# EAGLE design scaremin (EAGLE 7.7.0)
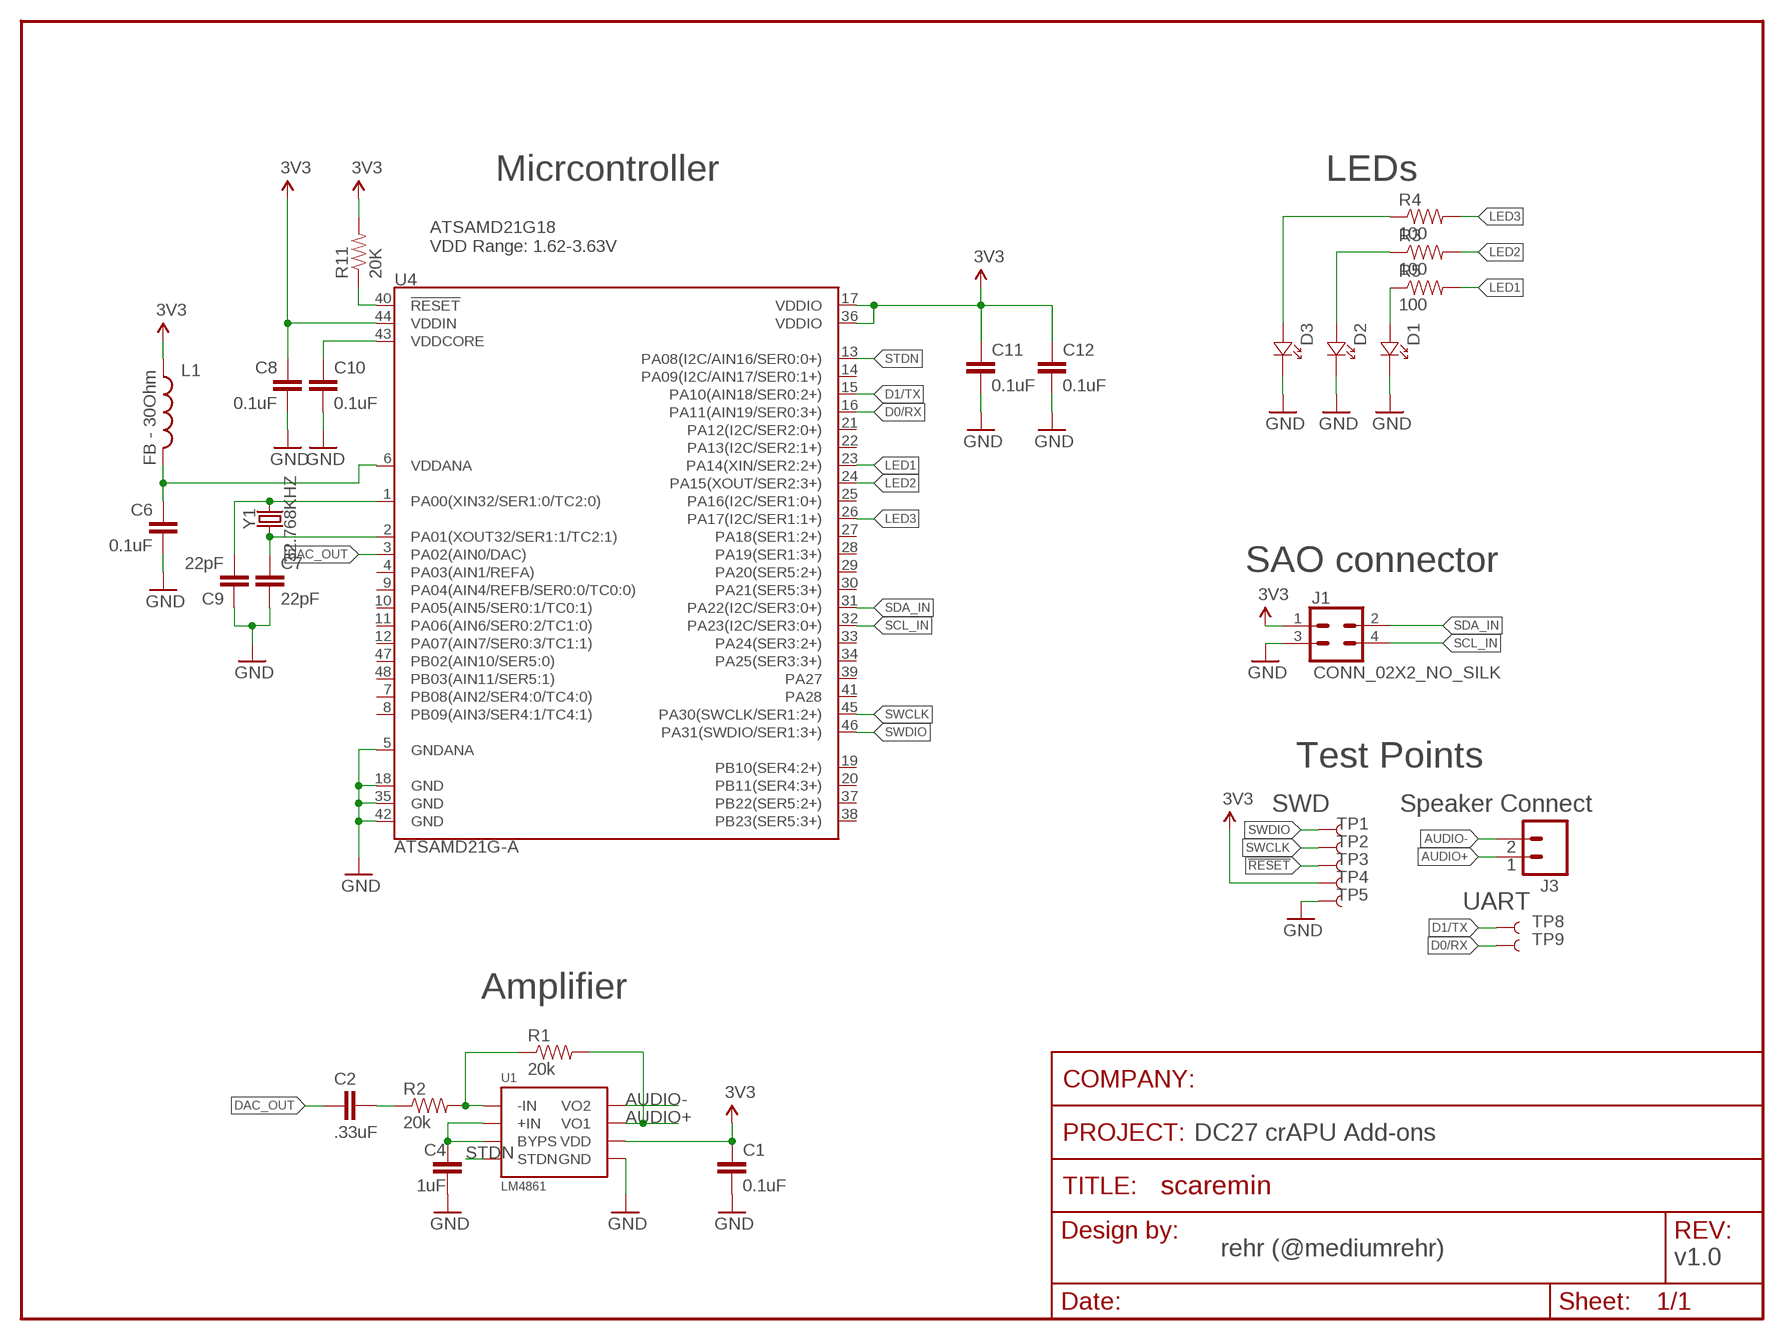
[diagram p0: schematic, sheet 1]

## Parts
C1  0.1uF  CAP0603-CAP  [0603-CAP]
C2  .33uF  CAP0603-CAP  [0603-CAP]
C4  1uF  CAP0603-CAP  [0603-CAP]
C6  0.1uF  0.1UF-25V(+80/-20%)(0603)  [0603-CAP]
C7  22pF  15PF-50V-5%(0603)  [0603-CAP]
C8  0.1uF  0.1UF-25V(+80/-20%)(0603)  [0603-CAP]
C9  22pF  15PF-50V-5%(0603)  [0603-CAP]
C10  0.1uF  0.1UF-25V(+80/-20%)(0603)  [0603-CAP]
C11  0.1uF  0.1UF-25V(+80/-20%)(0603)  [0603-CAP]
C12  0.1uF  0.1UF-25V(+80/-20%)(0603)  [0603-CAP]
D1  LED1206REVERSE_NO_SILK  [1206_NO_SILK]
D2  LED1206REVERSE_NO_SILK  [1206_NO_SILK]
D3  LED1206REVERSE_NO_SILK  [1206_NO_SILK]
FRAME1  FRAME-LETTER-BLANKNO_PACKAGE  [DUMMY]
J1  CONN_02X2_NO_SILK  [2X2_NO_SILK]
J3  M02ROUND  [M02_ROUND]
L1  FB - 30Ohm  INDUCTOR0603  [0603]
R1  20k  RESISTOR0805-RES  [0805]
R2  20k  RESISTOR0805-RES  [0805]
R3  100  10KOHM-1/10W-1%(0603)0603  [0603-RES]
R4  100  10KOHM-1/10W-1%(0603)0603  [0603-RES]
R5  100  10KOHM-1/10W-1%(0603)0603  [0603-RES]
R11  20K  10KOHM-1/10W-1%(0603)0603  [0603-RES]
TP1  TEST-POINT3X5  [PAD.03X.05]
TP2  TEST-POINT3X5  [PAD.03X.05]
TP3  TEST-POINT3X5  [PAD.03X.05]
TP4  TEST-POINT3X5  [PAD.03X.05]
TP5  TEST-POINT3X5  [PAD.03X.05]
TP8  TEST-POINT3X4  [PAD.03X.04]
TP9  TEST-POINT3X4  [PAD.03X.04]
U1  LM4861  [8-SOIC]
U4  ATSAMD21G-A  [TQFP-48]
Y1  32.768KHZ  ABS06-127-32.768KHZ  [ABS06]

## Nets
3.3V: C1.1 C8.1 C11.1 C12.1 J1.1 L1.1 R11.2 TP4.P$1 U1.P$6(VDD) U4.17(VDDIO) U4.36(VDDIO) U4.44(VDDIN) ; supply symbol labelled 3V3
!RESET: R11.1 TP3.P$1 U4.40(!RESET!)
AUDIO+: J3.P$1 R1.2 U1.P$5(VO1)
AUDIO-: J3.P$2 U1.P$8(VO2)
D0/RX: TP9.P$1 U4.16(PA11(AIN19/SER0:3+))
D1/TX: TP8.P$1 U4.15(PA10(AIN18/SER0:2+))
DAC_OUT: C2.2 U4.3(PA02(AIN0/DAC))
GND: C1.2 C4.2 C6.2 C7.2 C8.2 C9.1 C10.2 C11.2 C12.2 D1.P$1 D2.P$1 D3.P$1 J1.3 TP5.P$1 U1.P$7(GND) U4.5(GNDANA) U4.18(GND) U4.35(GND) U4.42(GND)
LED1: R5.2 U4.23(PA14(XIN/SER2:2+))
LED2: R3.2 U4.24(PA15(XOUT/SER2:3+))
LED3: R4.2 U4.26(PA17(I2C/SER1:1+))
N$1: C2.1 R2.1
N$2: R1.1 R2.2 U1.P$4(-IN)
N$3: D1.P$2 R5.1
N$4: C7.1 U4.2(PA01(XOUT32/SER1:1/TC2:1)) Y1.P$1
N$5: C4.1 U1.P$2(BYPS) U1.P$3(+IN)
N$6: D2.P$2 R3.1
N$7: D3.P$2 R4.1
N$9: C9.2 U4.1(PA00(XIN32/SER1:0/TC2:0)) Y1.P$2
SCL_IN: J1.4 U4.32(PA23(I2C/SER3:0+))
SDA_IN: J1.2 U4.31(PA22(I2C/SER3:0+))
STDN: U1.P$1(STDN) U4.13(PA08(I2C/AIN16/SER0:0+))
SWCLK: TP2.P$1 U4.45(PA30(SWCLK/SER1:2+))
SWDIO: TP1.P$1 U4.46(PA31(SWDIO/SER1:3+))
VDDANA: C6.1 L1.2 U4.6(VDDANA)
VDDCORE: C10.1 U4.43(VDDCORE)
Unconnected: U4.4(PA03(AIN1/REFA)) U4.7(PB08(AIN2/SER4:0/TC4:0)) U4.8(PB09(AIN3/SER4:1/TC4:1)) U4.9(PA04(AIN4/REFB/SER0:0/TC0:0)) U4.10(PA05(AIN5/SER0:1/TC0:1)) U4.11(PA06(AIN6/SER0:2/TC1:0)) U4.12(PA07(AIN7/SER0:3/TC1:1)) U4.14(PA09(I2C/AIN17/SER0:1+)) U4.19(PB10(SER4:2+)) U4.20(PB11(SER4:3+)) U4.21(PA12(I2C/SER2:0+)) U4.22(PA13(I2C/SER2:1+)) U4.25(PA16(I2C/SER1:0+)) U4.27(PA18(SER1:2+)) U4.28(PA19(SER1:3+)) U4.29(PA20(SER5:2+)) U4.30(PA21(SER5:3+)) U4.33(PA24(SER3:2+)) U4.34(PA25(SER3:3+)) U4.37(PB22(SER5:2+)) U4.38(PB23(SER5:3+)) U4.39(PA27) U4.41(PA28) U4.47(PB02(AIN10/SER5:0)) U4.48(PB03(AIN11/SER5:1))

## Notes on the sheet
- Micrcontroller | LEDs
- ATSAMD21G18
  VDD Range: 1.62-3.63V
- SAO connector
- Test Points
- SWD | Speaker Connect
- UART
- Amplifier
- DC27 crAPU Add-ons
- rehr (@mediumrehr)
- v1.0

## Library data of the parts
C1 C2 C4 = SparkFun-Passives:CAP: Capacitor Standard 0603 ceramic capacitor, and 0.1" leaded capacitor.
C6 C8 C10-C12 = SparkFun-Capacitors:0.1UF-25V(+80/-20%)(0603): CAP-00810 Ceramic Standard decoupling cap; PROD_ID: CAP-00810
C7 C9 = SparkFun-Capacitors:15PF-50V-5%(0603): CAP-07881; PROD_ID: CAP-07881; VALUE: 15pF
D1-D3 = IDEO-Diodes:LED1206
FRAME1 = SparkFun-Aesthetics:FRAME-LETTER-BLANK: Schematic Frame - Letter Standard 8.5x11 US Letter frame; DESIGNER: Nobody; VERSION: v01
J1 = SparkFun-Connectors:CONN_02X2
J3 = IDEO-Connectors:M02
L1 = SparkFun-Passives:INDUCTOR: Inductors Basic Inductor/Choke - 0603 and 1206. Footprints are not proven and vary greatly between part numbers. INDUCTOR POWER 3.3UH 4.0A SMD 0.197" L x 0.197" W x 0.177" H (5.00mm x 5.00mm x 4.50mm); PROD_ID: RES-07859
R1 R2 = SparkFun-Passives:RESISTOR: Resistor Basic schematic elements and footprints for 0603, 1206, and PTH resistors.
R3-R5 R11 = SparkFun-Resistors:10KOHM-1/10W-1%(0603): RES-00824; PROD_ID: RES-00824; VALUE: 10K
TP1-TP5 TP8 TP9 = SparkFun-Connectors:TEST-POINT: SparkFun Test Points Bare copper test points for troubleshooting or In-Circuit-Testing. These are used by our Production team for verifying production board runs using pogo-pins on test beds. SparkFun Products: SparkFun LSM9DS1 Breakout <https://www.sparkfun.com/products/13284> SparkFun PSOC <https://www.sparkfun.com/products/13714> SparkFun Load Cell Amplifier <https://www.sparkfun.com/products/13879>
U1 = IDEO-ICs:LM4861
U4 = samd21-temp:ATSAMD21G: Atmel SAMD21G SMART ARM-Based Microcontroller The Atmel ® | SMART ™ SAM D21 is a series of low-power microcontrollers using the 32-bit ARM ® Cortex ® -M0+ processor, and ranging from 32- to 64-pins with up to 256KB Flash and 32KB of SRAM. The SAM D21 devices operate at a maximum frequency of 48MHz and reach 2.46 CoreMark/MHz. They are designed for simple and intuitive migration with identical peripheral modules, hex compatible code, identical linear address map and pin compatible migration paths between all devices in the product series. All devices include intelligent and flexible peripherals, Atmel Event System for inter-peripheral signaling, and support for capacitive touch button, slider and wheel user interfaces.; PROD_ID: IC-13064
Y1 = IDEO-Clocks:ABS06-127-32.768KHZ

## Board
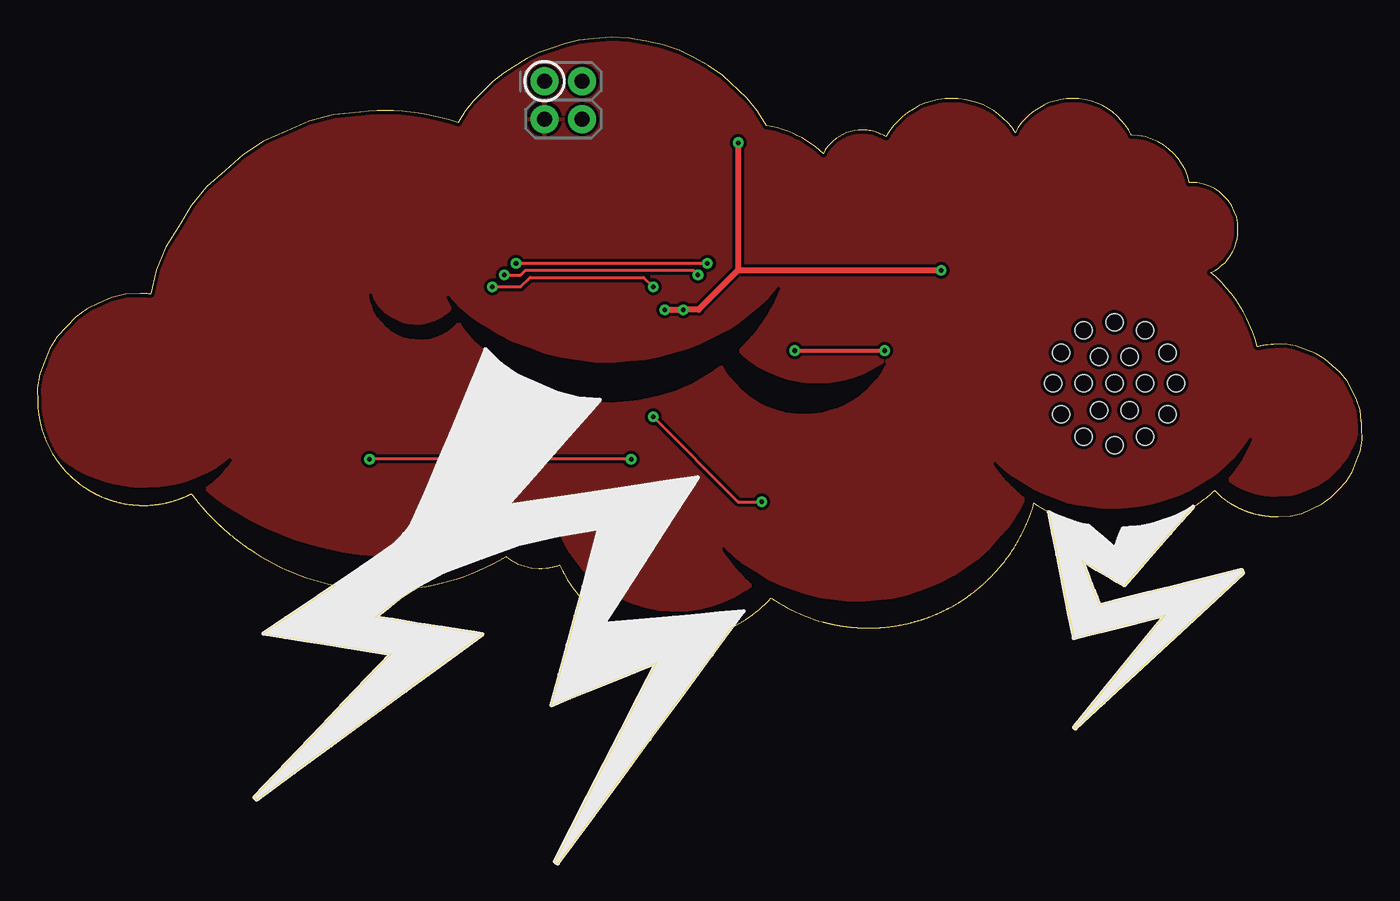
[diagram p1: board, top side]
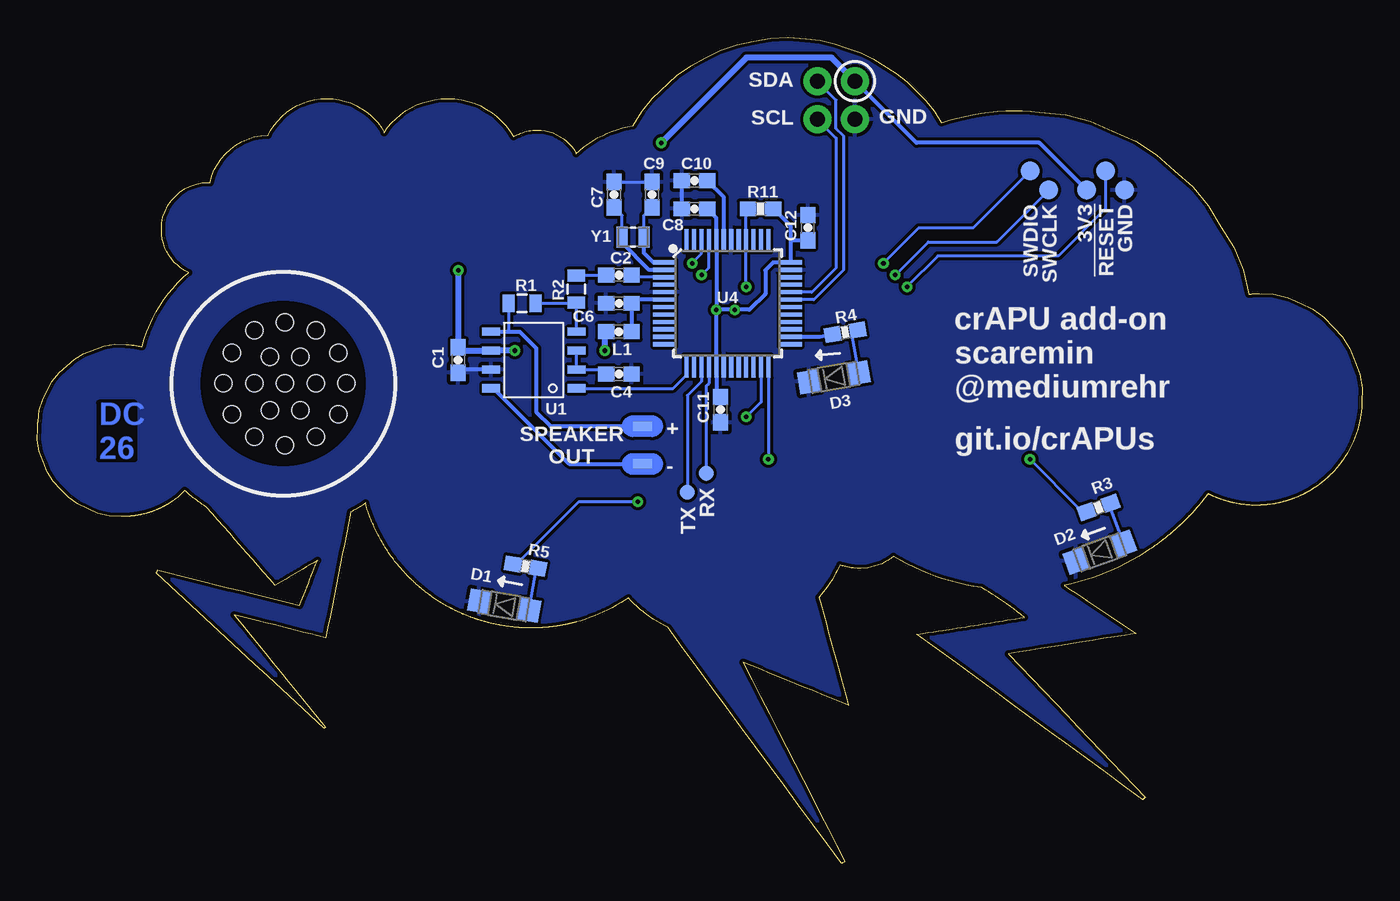
[diagram p2: board, bottom side, seen from below]

Size 89.04 x 55.53 mm. Coordinates in mm from the lower left corner, seen from the top.
Outline: 88.98,29.72 88.98,29.72
Outline: 88.98,29.72 88.9,30.46 88.68,31.16 88.35,31.79 88.02,32.42 87.57,32.98 86.52,33.91 85.9,34.28 84.56,34.77 83.83,34.9 83.07,34.87 82.98,34.87 82.89,34.87 82.7,34.85 82.61,34.84 82.52,34.83 82.43,34.82 82.34,34.81 82.25,34.79 82.16,34.77 82.07,34.76 81.99,34.74 81.86,35.23 81.69,35.71 81.29,36.64 81.06,37.08 80.53,37.91 80.23,38.31 79.91,38.68 79.59,39.05 79.24,39.4 78.87,39.72 79.13,39.85 79.38,40.01 79.6,40.2 79.82,40.4 80.02,40.62 80.18,40.87 80.34,41.12 80.46,41.39 80.55,41.68 80.64,41.96 80.68,42.27 80.68,43.02 80.6,43.44 80.43,43.82 80.27,44.2 80.04,44.54 79.75,44.83 79.47,45.12 79.12,45.35 78.74,45.51 78.36,45.67 77.95,45.76 77.5,45.76 77.49,45.76 77.48,45.76 77.48,45.76 77.47,45.76 77.46,45.76 77.45,45.76 77.44,45.76 77.43,45.76 77.42,45.76 77.41,45.76 77.31,46.21 77.14,46.63 76.91,47 76.67,47.38 76.38,47.72 76.04,48 75.69,48.29 75.31,48.51 74.46,48.83 74,48.92 73.53,48.93 73.35,49.3 73.12,49.64 72.85,49.94 72.58,50.24 72.27,50.5 71.93,50.72 71.59,50.94 71.22,51.11 70.82,51.23 70.43,51.34 70.01,51.41 69.16,51.41 68.75,51.35 68.37,51.24 67.99,51.13 67.63,50.98 67.3,50.78 66.97,50.58 66.67,50.33 66.4,50.06 66.13,49.78 65.9,49.47 65.71,49.13 65.48,49.47 65.21,49.79 64.91,50.06 64.61,50.34 64.27,50.58 63.91,50.78 63.54,50.98 63.15,51.14 62.33,51.35 61.9,51.41 60.98,51.41 60.53,51.34 59.66,51.1 59.24,50.92 58.86,50.7 58.48,50.47 58.14,50.2 57.83,49.89 57.52,49.58 57.25,49.23 57.03,48.84 56.91,48.91 56.8,48.98 56.67,49.03 56.55,49.09 56.42,49.13 56.29,49.17 56.16,49.21 56.02,49.24 55.88,49.26 55.75,49.28 55.6,49.29 55.17,49.29 54.9,49.25 54.64,49.17 54.38,49.1 54.13,48.99 53.9,48.85 53.67,48.71 53.47,48.55 53.28,48.35 53.1,48.16 52.95,47.95 52.82,47.71 52.56,47.95 52.28,48.18 51.98,48.38 51.69,48.58 51.38,48.77 51.06,48.92 50.74,49.08 50.41,49.22 50.06,49.33 49.72,49.44 49.36,49.53 49,49.59 48.41,50.56 47.69,51.44 46.05,52.97 45.12,53.63 44.12,54.14 43.11,54.66 42.03,55.03 40.9,55.25 39.77,55.47 38.59,55.53 37.38,55.41 36.41,55.32 35.47,55.11 34.59,54.8 33.7,54.5 32.87,54.09 31.32,53.12 30.61,52.54 29.97,51.9 29.33,51.26 28.76,50.55 28.28,49.78 27.76,49.95 27.24,50.1 26.17,50.33 25.62,50.42 24.52,50.54 23.96,50.58 22.83,50.59 22.26,50.56 21.68,50.5 19.93,50.33 18.28,49.88 16.76,49.21 15.23,48.54 13.84,47.64 12.62,46.55 11.39,45.47 10.34,44.21 9.5,42.82 8.65,41.42 8.01,39.89 7.62,38.28 7.57,38.28 7.51,38.28 7.46,38.29 7.41,38.29 7.35,38.29 7.3,38.29 7.24,38.29 7.19,38.29 7.14,38.29 7.08,38.29 7.03,38.29 6.97,38.29 6.97,38.29 6.97,38.29 6.96,38.29 6.96,38.29 6.96,38.29 6.95,38.29 6.95,38.29 6.95,38.29 6.94,38.29 6.93,38.29 6.93,38.29 5.95,38.26 5.02,38.04 4.18,37.65 3.34,37.27 2.59,36.72 1.96,36.06 1.34,35.4 0.84,34.62 0.51,33.76 0.17,32.9 0,31.96 0.03,30.98 0.04,30.66 0.07,30.36 0.16,29.76 0.23,29.47 0.31,29.18 0.4,28.89 0.5,28.62 0.62,28.35 0.73,28.08 0.87,27.82 1.01,27.57 1.04,27.53 1.06,27.49 1.08,27.45 1.11,27.42 1.13,27.38 1.16,27.34 1.18,27.3 1.2,27.27 1.23,27.23 1.25,27.19 1.28,27.16 1.3,27.12 1.32,27.1 1.33,27.09 1.35,27.05 1.36,27.04 1.39,27 1.4,26.98 1.43,26.95 1.44,26.93 1.45,26.92 1.47,26.89 1.49,26.87 1.51,26.84 1.53,26.82 1.55,26.8 1.57,26.77 1.58,26.75 1.6,26.72 1.62,26.7 1.64,26.68 1.66,26.65 1.68,26.63 1.69,26.62 1.71,26.6 1.72,26.59 1.73,26.57 1.74,26.56 1.77,26.53 1.78,26.51 1.79,26.5 1.8,26.48 1.82,26.47 1.83,26.45 1.86,26.42 1.89,26.39 1.92,26.35 1.95,26.32 1.98,26.29 2.04,26.22 2.07,26.19 2.14,26.13 2.17,26.1 2.2,26.07 2.21,26.05 2.23,26.04 2.24,26.03 2.26,26.02 2.27,26 2.28,25.99 2.3,25.98 2.31,25.96 2.33,25.95 2.34,25.94 2.35,25.93 2.37,25.91 2.39,25.89 2.42,25.87 2.44,25.85 2.47,25.83 2.49,25.81 2.52,25.78 2.54,25.76 2.57,25.74 2.59,25.72 2.62,25.7 2.64,25.68 2.67,25.66 2.68,25.65 2.69,25.64 2.71,25.62 2.72,25.61 2.74,25.6 2.75,25.59 2.76,25.58 2.78,25.57 2.8,25.55 2.82,25.54 2.83,25.52 2.87,25.5 2.91,25.47 2.98,25.41 3.02,25.39 3.09,25.33 3.13,25.31 3.17,25.28 3.21,25.26 3.25,25.23 3.29,25.2 3.3,25.2 3.31,25.19 3.33,25.18 3.34,25.17 3.35,25.16 3.37,25.16 3.38,25.15 3.39,25.14 3.41,25.13 3.42,25.12 3.43,25.12 3.45,25.11 3.48,25.09 3.51,25.07 3.54,25.05 3.57,25.03 3.6,25.02 3.63,25 3.67,24.98 3.7,24.96 3.73,24.94 3.76,24.93 3.8,24.91 3.83,24.89 3.84,24.88 3.86,24.88 3.87,24.87 3.88,24.86 3.9,24.85 3.91,24.85 3.93,24.84 3.94,24.83 3.97,24.82 3.98,24.81 4,24.8 4.04,24.78 4.08,24.76 4.13,24.74 4.17,24.72 4.22,24.7 4.26,24.68 4.3,24.66 4.35,24.64 4.44,24.6 4.48,24.58 4.53,24.57 4.54,24.56 4.55,24.56 4.57,24.55 4.58,24.55 4.59,24.54 4.6,24.54 4.61,24.54 4.62,24.53 4.63,24.53 4.64,24.52 4.65,24.52 4.69,24.51 4.73,24.49 4.77,24.48 4.81,24.46 4.85,24.45 4.89,24.44 4.93,24.42 4.97,24.41 5.01,24.4 5.05,24.39 5.09,24.37 5.13,24.36 5.14,24.36 5.15,24.35 5.17,24.35 5.18,24.35 5.2,24.34 5.21,24.34 5.22,24.33 5.24,24.33 5.25,24.33 5.27,24.32 5.28,24.32 5.29,24.32 5.34,24.3 5.39,24.29 5.44,24.28 5.49,24.26 5.54,24.25 5.59,24.24 5.64,24.23 5.69,24.22 5.74,24.21 5.79,24.2 5.84,24.19 5.89,24.18 5.9,24.18 5.9,24.18 5.91,24.18 5.92,24.18 5.92,24.17 5.93,24.17 5.94,24.17 5.94,24.17 5.95,24.17 5.95,24.17 5.96,24.17 5.97,24.17 6.01,24.16 6.06,24.15 6.15,24.14 6.2,24.13 6.25,24.13 6.29,24.12 6.34,24.12 6.39,24.11 6.43,24.11 6.48,24.1 6.53,24.1 6.54,24.1 6.56,24.1 6.57,24.1 6.58,24.1 6.6,24.09 6.63,24.09 6.64,24.09 6.67,24.09 6.68,24.09 6.7,24.09 6.75,24.08 6.8,24.08 6.86,24.08 6.91,24.08 6.97,24.07 7.02,24.07 7.07,24.07 7.13,24.07 7.18,24.07 7.24,24.07 7.29,24.07 7.34,24.07 7.4,24.07 7.46,24.08 7.57,24.08 7.62,24.09 7.73,24.1 7.79,24.1 7.84,24.11 7.9,24.11 7.95,24.12 8,24.13 8.01,24.13 8.02,24.13 8.03,24.13 8.04,24.13 8.05,24.13 8.06,24.13 8.07,24.13 8.08,24.13 8.09,24.14 8.1,24.14 8.1,24.14 8.15,24.14 8.2,24.15 8.25,24.16 8.3,24.17 8.35,24.18 8.39,24.18 8.44,24.19 8.49,24.2 8.58,24.22 8.63,24.23 8.68,24.24 8.69,24.25 8.71,24.25 8.72,24.25 8.74,24.26 8.75,24.26 8.77,24.26 8.78,24.27 8.8,24.27 8.81,24.27 8.82,24.28 8.84,24.28 8.85,24.28 8.9,24.29 8.94,24.3 8.98,24.31 9.02,24.33 9.06,24.34 9.14,24.36 9.18,24.37 9.22,24.39 9.26,24.4 9.3,24.41 9.34,24.42 9.36,24.43 9.38,24.44 9.43,24.45 9.45,24.46 9.47,24.47 9.49,24.47 9.51,24.48 9.53,24.49 9.55,24.5 9.57,24.5 9.59,24.51 9.61,24.52 9.64,24.53 9.67,24.54 9.69,24.55 9.72,24.56 9.77,24.58 9.79,24.59 9.82,24.6 9.84,24.61 9.87,24.62 9.89,24.63 9.93,24.65 9.96,24.66 10,24.68 10.03,24.69 10.06,24.71 10.1,24.72 10.13,24.74 10.17,24.75 10.2,24.77 10.24,24.79 10.27,24.8 10.3,24.82 10.31,24.82 10.31,24.82 10.32,24.83 10.33,24.83 10.34,24.84 10.34,24.84 10.35,24.84 10.36,24.84 10.36,24.85 10.36,24.85
Outline: 10.36,24.85 10.36,24.85
Outline: 10.36,24.85 10.36,24.85 10.36,24.84
Outline: 10.36,24.84 10.36,24.84
Outline: 10.36,24.84 10.36,24.84 10.36,24.84 10.36,24.84 10.36,24.84 10.36,24.84 10.39,24.81 10.41,24.78 10.43,24.75 10.45,24.72 10.48,24.7 10.5,24.67 10.52,24.64 10.55,24.61 10.57,24.58 10.59,24.55 10.61,24.52 10.64,24.49 10.65,24.47 10.67,24.45 10.69,24.43 10.7,24.41 10.72,24.39 10.73,24.37 10.75,24.35 10.76,24.33 10.8,24.29 10.81,24.27 10.83,24.25 10.85,24.22 10.88,24.19 10.93,24.14 10.95,24.11 11,24.05 11.02,24.02 11.07,23.97 11.1,23.94 11.12,23.91 11.14,23.89 11.15,23.87 11.17,23.85 11.19,23.84 11.2,23.82 11.22,23.8 11.24,23.78 11.25,23.76 11.27,23.74 11.28,23.72 11.3,23.7 11.32,23.69 11.34,23.66 11.37,23.63 11.4,23.6 11.42,23.57 11.45,23.54 11.5,23.48 11.53,23.46 11.59,23.4 11.61,23.37 11.64,23.34 11.66,23.33 11.67,23.31 11.69,23.29 11.7,23.28 11.72,23.26 11.73,23.25 11.75,23.23 11.76,23.21 11.78,23.2 11.8,23.18 11.81,23.16 11.83,23.15 11.86,23.12 11.89,23.09 11.95,23.03 11.98,23 12.04,22.94 12.07,22.91 12.13,22.86 12.16,22.83 12.19,22.8 12.2,22.78 12.22,22.77 12.23,22.76 12.24,22.74 12.26,22.73 12.27,22.72 12.29,22.7 12.3,22.69 12.31,22.68 12.33,22.67 12.34,22.65 12.36,22.64 12.39,22.61 12.42,22.58 12.49,22.52 12.52,22.49 12.56,22.46 12.59,22.43 12.63,22.4 12.66,22.37 12.69,22.34 12.73,22.31 12.76,22.28 12.77,22.27 12.79,22.26 12.8,22.25 12.81,22.24 12.82,22.23 12.83,22.22 12.84,22.21 12.86,22.2 12.87,22.19 12.88,22.18 12.89,22.17 12.9,22.16 12.94,22.13 12.98,22.1 13.02,22.07 13.05,22.03 13.09,22 13.13,21.97 13.17,21.94 13.21,21.91 13.28,21.85 13.32,21.82 13.36,21.79 13.37,21.78 13.38,21.78 13.38,21.77 13.39,21.76 13.4,21.76 13.42,21.74 13.43,21.74 13.44,21.73 13.45,21.72 13.45,21.72 13.46,21.71 13.51,21.68 13.55,21.64 13.59,21.61 13.63,21.58 13.68,21.55 13.76,21.49 13.8,21.45 13.85,21.42 13.89,21.39 13.93,21.36 13.98,21.33 13.98,21.33 13.99,21.32 13.99,21.32 14,21.32 14,21.31 14.01,21.31 14.01,21.31 14.02,21.3 14.02,21.3 14.03,21.3 14.03,21.29 14.04,21.29 14.08,21.25 14.13,21.22 14.18,21.19 14.23,21.16 14.27,21.12 14.32,21.09 14.37,21.06 14.42,21.03 14.47,21 14.52,20.97 14.56,20.93 14.61,20.9 14.61,20.9 14.61,20.9 14.62,20.9 14.62,20.9
Outline: 14.62,20.9 14.62,20.9
Outline: 14.62,20.9 14.62,20.9
Outline: 14.62,20.9 14.62,20.9
Outline: 14.62,20.9 14.62,20.9 14.62,20.9 14.62,20.9 15.03,20.64 15.45,20.39 15.88,20.17 16.31,19.95 16.76,19.74 17.21,19.56 17.66,19.37 18.13,19.21 18.6,19.06 19.07,18.92 19.55,18.8 20.04,18.7 19.65,18.44 19.25,18.17 18.86,17.91 18.46,17.64 18.07,17.38 17.66,17.11 17.26,16.84 16.86,16.57 16.03,16.02 15.62,15.74 15.2,15.46 15.95,15.34 16.67,15.23 17.38,15.11 18.1,15 18.8,14.89 20.2,14.67 20.9,14.56 21.61,14.45 22.32,14.33 23.04,14.22 23.79,14.1 22.98,13.26 22.19,12.43 21.41,11.61 20.63,10.79 19.86,9.98 19.1,9.18 18.34,8.38 17.58,7.59 16.83,6.8 16.08,6.01 14.59,4.44 14.62,4.42 14.63,4.4 14.66,4.38 14.67,4.37 14.69,4.35 14.7,4.34 14.71,4.33 14.73,4.31 14.74,4.3 14.75,4.29 16,5.2 17.24,6.11 19.73,7.94 20.98,8.86 23.5,10.7 24.76,11.63 26.04,12.57 27.32,13.51 28.61,14.45 29.92,15.41 29.53,15.47 29.17,15.52 28.83,15.58 28.49,15.63 28.17,15.68 27.54,15.77 27.24,15.82 26.94,15.86 26.65,15.91 26.36,15.95 26.07,16 25.8,16.04 25.53,16.09 25.25,16.13 24.98,16.18 24.7,16.22 24.42,16.27 24.15,16.31 23.87,16.36 23.3,16.45 23.01,16.5 22.72,16.55 22.95,16.74 23.19,16.92 23.42,17.1 23.66,17.27 23.9,17.44 24.37,17.78 24.61,17.94 24.86,18.09 25.1,18.25 25.34,18.4 25.59,18.54 26.12,18.62 26.65,18.72 27.17,18.85 27.68,18.98 28.19,19.13 28.68,19.31 29.17,19.48 29.66,19.68 30.59,20.12 31.05,20.37 31.49,20.63 31.68,20.49 31.87,20.36 32.08,20.25 32.29,20.15 32.51,20.06 32.97,19.92 33.2,19.88 33.69,19.83 33.94,19.83 34.19,19.86 34.27,19.86 34.35,19.87 34.42,19.89 34.5,19.9 34.58,19.92 34.65,19.93 34.73,19.95 34.81,19.97 34.88,19.99 34.95,20.01 35.03,20.04 35.1,20.06 35.19,19.86 35.29,19.67 35.39,19.48 35.5,19.29 35.61,19.1 35.84,18.74 35.97,18.56 36.1,18.39 36.23,18.22 36.36,18.06 36.51,17.89 36.35,17.3 36.18,16.7 36.02,16.1 35.86,15.51 35.7,14.91 35.53,14.31 35.37,13.7 35.2,13.1 35.04,12.49 34.87,11.88 34.71,11.26 34.54,10.64 35.16,10.9 35.76,11.14 36.35,11.38 36.94,11.62 37.51,11.85 38.67,12.32 39.24,12.56 39.82,12.79 40.41,13.03 41,13.27 41.62,13.52 41.01,12.35 40.42,11.19 39.84,10.05 39.26,8.91 38.69,7.79 38.12,6.68 37.55,5.58 36.99,4.48 36.43,3.39 35.87,2.3 35.32,1.21 34.76,0.12 34.78,0.11 34.8,0.1 34.82,0.09 34.84,0.08 34.9,0.05 34.92,0.04 34.94,0.03 34.96,0.02 34.98,0.01 34.99,0 35.95,1.3 36.91,2.6 37.87,3.91 38.83,5.22 39.8,6.53 40.76,7.84 41.73,9.16 42.71,10.48 43.69,11.82 44.67,13.16 45.66,14.5 46.67,15.86 46.92,15.98 47.16,16.12 47.4,16.26 47.64,16.41 47.87,16.57 48.09,16.73 48.31,16.9 48.53,17.08 48.73,17.27 48.93,17.45 49.13,17.65 49.31,17.85 49.58,17.67 49.85,17.5 50.13,17.34 50.41,17.18 50.69,17.04 50.99,16.9 51.28,16.76 51.58,16.64 51.88,16.53 52.19,16.42 52.5,16.32 52.81,16.23 52.82,16.23 52.82,16.23 52.83,16.23 52.84,16.23 52.84,16.22 52.85,16.22 52.86,16.22 52.87,16.22 52.87,16.21 52.88,16.21 52.88,16.21 52.91,16.2 52.94,16.2 52.97,16.19 53,16.18 53.03,16.17 53.06,16.17 53.09,16.16 53.12,16.15 53.15,16.15 53.18,16.14 53.21,16.13 53.24,16.13 53.25,16.12 53.27,16.12 53.28,16.11 53.3,16.11 53.31,16.11 53.33,16.1 53.34,16.1 53.36,16.1 53.37,16.09 53.39,16.09 53.4,16.09 53.42,16.08 53.44,16.08 53.47,16.07 53.49,16.07 53.52,16.06 53.55,16.06 53.57,16.05 53.6,16.05 53.62,16.04 53.65,16.04 53.68,16.03 53.7,16.03 53.73,16.02 53.75,16.02 53.77,16.01 53.8,16.01 53.82,16 53.84,16 53.86,16 53.88,15.99 53.9,15.99 53.92,15.99 53.94,15.98 53.96,15.98 53.98,15.98 54,15.97 54.03,15.97 54.05,15.97 54.08,15.96 54.1,15.96 54.12,15.95 54.15,15.95 54.2,15.94 54.22,15.94 54.25,15.94 54.27,15.93 54.29,15.93 54.31,15.93 54.33,15.93 54.35,15.92 54.38,15.92 54.4,15.92 54.42,15.91 54.44,15.91 54.46,15.91 54.48,15.91 54.51,15.9 54.53,15.9 54.55,15.9 54.57,15.9 54.6,15.89 54.62,15.89 54.64,15.89 54.66,15.89 54.69,15.88 54.73,15.88 54.76,15.88 54.78,15.87 54.8,15.87 54.83,15.87 54.85,15.87 54.87,15.87 54.9,15.86 54.92,15.86 54.95,15.86 54.97,15.86 54.99,15.86 55.02,15.86 55.04,15.85 55.06,15.85 55.09,15.85 55.11,15.85 55.15,15.85 55.17,15.85 55.19,15.84 55.21,15.84 55.24,15.84 55.26,15.84 55.28,15.84 55.3,15.84 55.32,15.84 55.35,15.84 55.37,15.83 55.4,15.83 55.43,15.83 55.45,15.83 55.51,15.83 55.53,15.83 55.56,15.83 55.59,15.83 55.61,15.83 55.64,15.83 55.66,15.83 55.68,15.83 55.7,15.83 55.72,15.83 55.74,15.83 55.76,15.83 55.78,15.83 55.8,15.83 55.81,15.83 55.83,15.82 55.85,15.82 55.87,15.82 55.9,15.82 55.93,15.83 55.97,15.83 56,15.83 56.03,15.83 56.06,15.83 56.09,15.83 56.12,15.83 56.15,15.83 56.18,15.83 56.21,15.83 56.24,15.83 56.26,15.83 56.27,15.83 56.29,15.83 56.3,15.83 56.32,15.84 56.34,15.84 56.35,15.84 56.37,15.84 56.4,15.84 56.42,15.84 56.43,15.84 56.48,15.84 56.53,15.84 56.57,15.85 56.62,15.85 56.67,15.85 56.71,15.86 56.76,15.86 56.81,15.86 56.86,15.87 56.9,15.87 56.95,15.88 57,15.88 57.07,15.89 57.13,15.89 57.2,15.9 57.27,15.91 57.33,15.92 57.4,15.93 57.47,15.94 57.53,15.95 57.6,15.96 57.67,15.97 57.73,15.98 57.8,15.99 57.81,15.99 57.83,16 57.85,16 57.86,16 57.88,16 57.89,16.01 57.91,16.01 57.92,16.01 57.96,16.02 57.97,16.02 57.99,16.02 58.05,16.04 58.12,16.05 58.18,16.06 58.25,16.08 58.31,16.09 58.38,16.1 58.44,16.12 58.5,16.13 58.57,16.15 58.63,16.16 58.7,16.18 58.76,16.19 58.76,16.19 58.77,16.2 58.77,16.2 58.78,16.2 58.78,16.2 58.79,16.2 58.79,16.2 58.8,16.2 58.8,16.2 58.8,16.21 58.81,16.21 58.81,16.21 58.87,16.22 58.93,16.24 58.99,16.26 59.05,16.27 59.11,16.29 59.17,16.31 59.23,16.33 59.29,16.35 59.35,16.36 59.41,16.38 59.46,16.4 59.52,16.42 59.54,16.43 59.55,16.43 59.56,16.43 59.58,16.44 59.59,16.44 59.61,16.45 59.62,16.45 59.63,16.46 59.65,16.46 59.66,16.47 59.67,16.47 59.69,16.48 59.75,16.5 59.81,16.52 59.87,16.54 59.93,16.56 59.99,16.59 60.11,16.63 60.17,16.66 60.23,16.68 60.29,16.71 60.35,16.73 60.41,16.76 60.42,16.76 60.42,16.76 60.43,16.76 60.44,16.77 60.44,16.77 60.45,16.77 60.45,16.78 60.46,16.78 60.47,16.78 60.47,16.78 60.48,16.79 60.48,16.79 60.54,16.81 60.59,16.84 60.65,16.86 60.7,16.89 60.76,16.91 60.87,16.96 60.92,16.99 60.97,17.02 61.03,17.04 61.08,17.07 61.13,17.1 61.14,17.1 61.16,17.11 61.17,17.11 61.18,17.12 61.19,17.13 61.2,17.13 61.21,17.14 61.22,17.14 61.24,17.15 61.25,17.16 61.26,17.16 61.32,17.2 61.38,17.23 61.49,17.29 61.55,17.32 61.61,17.35 61.66,17.38 61.72,17.42 61.77,17.45 61.83,17.48 61.89,17.52 61.94,17.55 61.95,17.55 61.95,17.56 61.96,17.56 61.96,17.56 61.97,17.57 61.97,17.57 61.98,17.58 61.98,17.58 62,17.59 62,17.59 62.01,17.59 62.06,17.63 62.11,17.66 62.21,17.73 62.26,17.76 62.31,17.79 62.36,17.83 62.41,17.86 62.46,17.9 62.51,17.93 62.56,17.97 62.61,18 62.62,18.01 62.63,18.01 62.64,18.02 62.64,18.02 62.65,18.03 62.66,18.03 62.66,18.04 62.67,18.04 62.68,18.05 62.69,18.05 62.69,18.06 62.7,18.06 62.75,18.1 62.81,18.14 62.91,18.22 62.96,18.26 63.02,18.3 63.07,18.35 63.12,18.39 63.17,18.43 63.22,18.47 63.27,18.51 63.32,18.56 63.33,18.56 63.33,18.56 63.34,18.57 63.34,18.57 63.35,18.58 63.35,18.58 63.35,18.58 63.36,18.59 63.36,18.59 63.37,18.59 63.37,18.6 63.42,18.64 63.47,18.68 63.52,18.72 63.57,18.77 63.61,18.81 63.71,18.9 63.76,18.94 63.85,19.03 63.9,19.08 63.94,19.12 63.95,19.12 63.95,19.13 63.95,19.13 63.95,19.13 63.96,19.13 63.96,19.14 63.96,19.14 63.97,19.14 63.97,19.15 63.97,19.15 63.97,19.15 63.98,19.15 64.03,19.2 64.07,19.25 64.17,19.35 64.22,19.4 64.26,19.45 64.31,19.5 64.36,19.55 64.4,19.6 64.45,19.65 64.49,19.7 64.54,19.75 64.54,19.75 64.54,19.75 64.55,19.76 64.55,19.76 64.55,19.76 64.55,19.77 64.56,19.77 64.56,19.77 64.56,19.78 64.56,19.78 64.57,19.78 64.66,19.88 64.75,19.99 64.83,20.1 64.92,20.21 65.01,20.32 65.09,20.43 65.17,20.54 65.26,20.65 65.41,20.88 65.49,20.99 65.57,21.11 65.57,21.11 65.57,21.11 65.57,21.11 65.57,21.11 65.57,21.11 65.57,21.12 65.57,21.12 65.57,21.12 65.58,21.12 65.58,21.12 65.58,21.12 65.58,21.12 65.65,21.24 65.73,21.36 65.8,21.48 65.87,21.6 65.94,21.73 66.01,21.85 66.08,21.97 66.14,22.1 66.21,22.22 66.27,22.35 66.33,22.48 66.39,22.61
Outline: 66.39,22.61 66.39,22.61
Outline: 66.39,22.61 66.39,22.61
Outline: 66.39,22.61 66.39,22.61
Outline: 66.39,22.61 66.39,22.61
Outline: 66.39,22.61 66.39,22.61
Outline: 66.39,22.61 66.39,22.61
Outline: 66.39,22.61 66.39,22.61
Outline: 66.39,22.61 66.39,22.61 66.45,22.74 66.51,22.87 66.56,23 66.61,23.13 66.67,23.27 66.77,23.53 66.81,23.67 66.86,23.81 66.9,23.94 66.94,24.08 66.98,24.22 67.06,24.16 67.14,24.11 67.22,24.06 67.3,24.01 67.38,23.96 67.47,23.91 67.55,23.86 67.63,23.81 67.71,23.76 67.8,23.71 67.88,23.67 67.97,23.62 68.11,22.9 68.25,22.18 68.39,21.47 68.53,20.76 68.68,20.06 68.95,18.66 69.09,17.96 69.23,17.26 69.37,16.56 69.51,15.86 69.65,15.16 70.16,15.29 70.66,15.42 71.16,15.54 71.66,15.67 72.16,15.8 72.67,15.93 73.17,16.06 73.68,16.19 74.2,16.32 74.72,16.45 75.25,16.58 75.79,16.72 75.26,16.06 74.73,15.41 73.69,14.13 73.18,13.49 72.67,12.87 72.16,12.24 71.66,11.62 70.66,10.39 69.66,9.16 69.67,9.15 69.68,9.15 69.69,9.14 69.7,9.13 69.7,9.12 69.71,9.12 69.72,9.11 69.73,9.1 69.75,9.09 69.76,9.08 69.76,9.08 70.7,9.95 71.64,10.82 72.58,11.69 73.52,12.56 74.46,13.43 76.34,15.17 77.28,16.05 80.09,18.66 81.03,19.53 81.03,19.54 81.02,19.56 81.01,19.58 81,19.59 81,19.61 80.99,19.62 80.98,19.64 80.97,19.67 80.96,19.68 80.95,19.7 80.95,19.71 80.15,19.52 79.36,19.32 78.56,19.12 77.77,18.93 76.97,18.73 76.18,18.53 75.38,18.34 74.58,18.14 73.79,17.94 72.99,17.75 72.19,17.55 71.39,17.35 71.29,17.6 71.2,17.85 71.1,18.09 71.01,18.33 70.91,18.58 70.82,18.82 70.72,19.07 70.62,19.32 70.52,19.57 70.42,19.83 70.32,20.09 70.21,20.37 70.47,20.21 70.72,20.06 70.97,19.92 71.21,19.77 71.44,19.64 71.67,19.5 71.91,19.36 72.13,19.23 72.36,19.1 72.58,18.96 72.81,18.83 73.04,18.7 73.42,19.13 73.81,19.57 74.58,20.45 74.96,20.88 75.73,21.76 76.12,22.2 76.51,22.64 76.9,23.08 77.29,23.53 77.68,23.98 77.81,24.06 77.94,24.14 78.06,24.22 78.18,24.31 78.31,24.4 78.43,24.49 78.55,24.58 78.66,24.67 78.78,24.77 78.89,24.86 79.01,24.96 79.12,25.06
Outline: 79.12,25.06 79.12,25.06
Outline: 79.12,25.06 79.12,25.06
Outline: 79.12,25.06 79.12,25.06
Outline: 79.12,25.06 79.12,25.06
Outline: 79.12,25.06 79.18,24.99 79.25,24.92 79.39,24.79 79.47,24.73 79.54,24.67 79.61,24.61 79.69,24.55 79.76,24.49 79.84,24.43 79.92,24.37 80,24.32 80,24.32 80,24.32 80,24.32 80,24.32 80.01,24.32 80.01,24.31 80.01,24.31 80.01,24.31 80.01,24.31 80.01,24.31 80.01,24.31 80.05,24.28 80.09,24.26 80.13,24.24 80.17,24.21 80.21,24.19 80.24,24.16 80.28,24.14 80.32,24.12 80.4,24.07 80.44,24.05 80.48,24.03 80.48,24.02 80.49,24.02 80.49,24.02 80.49,24.02 80.5,24.02 80.5,24.02 80.5,24.01 80.51,24.01 80.51,24.01 80.51,24.01 80.52,24.01 80.52,24 80.56,23.98 80.6,23.96 80.64,23.94 80.67,23.93 80.71,23.91 80.75,23.89 80.79,23.87 80.83,23.85 80.87,23.83 80.91,23.82 80.95,23.8 80.98,23.78 80.99,23.78 81,23.78 81,23.77 81.01,23.77 81.02,23.77 81.02,23.77 81.03,23.76 81.03,23.76 81.04,23.76 81.05,23.76 81.05,23.75 81.06,23.75 81.1,23.73 81.13,23.72 81.17,23.71 81.21,23.69 81.24,23.68 81.28,23.67 81.32,23.65 81.36,23.64 81.4,23.63 81.43,23.61 81.47,23.6 81.51,23.59 81.52,23.59 81.53,23.58 81.55,23.58 81.56,23.57 81.57,23.57 81.58,23.56 81.6,23.56 81.61,23.56 81.62,23.55 81.66,23.54 81.69,23.53 81.77,23.51 81.8,23.5 81.84,23.5 81.87,23.49 81.91,23.48 81.98,23.46 82.02,23.45 82.06,23.45 82.07,23.44 82.08,23.44 82.09,23.44 82.11,23.44 82.12,23.43 82.13,23.43 82.14,23.43 82.15,23.42 82.17,23.42 82.18,23.42 82.19,23.42 82.2,23.41 82.24,23.41 82.28,23.4 82.35,23.39 82.39,23.39 82.42,23.38 82.46,23.38 82.5,23.37 82.53,23.37 82.57,23.36 82.61,23.36 82.65,23.36 82.66,23.35 82.67,23.35 82.68,23.35 82.7,23.35 82.71,23.35 82.74,23.34 82.75,23.34 82.76,23.34 82.77,23.34 82.79,23.34 82.8,23.34 82.85,23.33 82.9,23.33 83,23.33 83.05,23.32 83.1,23.32 83.15,23.32 83.2,23.32 83.25,23.32 83.31,23.32 83.36,23.32 83.41,23.32 84.21,23.35 84.96,23.53 86.33,24.15 86.94,24.6 87.44,25.13 87.95,25.67 88.36,26.31 88.63,27 88.9,27.7 89.04,28.47 89.02,29.27 89.02,29.3 89.01,29.34 89.01,29.42 89.01,29.46 89,29.49 89,29.53 89,29.57 88.99,29.61 88.99,29.64 88.98,29.68 88.98,29.72
Copper layers (1*16): Top 0.035mm / dielectric 1.5mm / Bottom 0.035mm
Design rules "default *": minimum track width 6mil, minimum drill 12mil, track to track 8mil, track to pad 8mil, pad to pad 8mil, via to via 8mil, smd to smd 8mil, copper to edge 10mil, drill to drill 8mil, minimum pad ring 10mil, minimum via ring 8mil, stop-mask expansion 4mil, vias tented up to drill 13mil, thermal gap 10mil
Holes 1.14 mm at 72.4,32.26 70.31,32.26 68.26,32.26 74.46,32.26 76.54,32.26 73.41,34.04 71.36,34.04 71.36,30.46 73.41,30.46 75.95,30.2 74.46,28.68 72.4,28.12 70.31,28.68 68.82,30.2 68.82,34.32 70.31,35.84 72.4,36.38 74.46,35.84 75.95,34.32
tRestrict: area 22.4,30.3 to 56.9,38.7; area 25.6,17.9 to 36.9,22; area 1,18.7 to 22.7,27.6; area 38.3,15.8 to 89,29.7
bRestrict: area 67.1,26.8 to 77.9,37.6

### Footprints (pad centres in the part's own frame; a part is rotated, then mirrored left to right if it is on the bottom)
0603-CAP = smd 1.1 x 1: 1 -0.85,0; 2 0.85,0
1206_NO_SILK = smd 1.4 x 1.5: P$1 -1.7,0; P$2 1.7,0
2X2_NO_SILK = drill 1.016 pad 1.88: 1 1.27,1.27; 2 1.27,3.81; 3 3.81,1.27; 4 3.81,3.81
M02_ROUND = smd 1.27 x 0.635: P$1 0,1.27; P$2 0,-1.27
0603 = smd 1.1 x 1: 1 -0.85,0; 2 0.85,0
0805 = smd 0.8 x 1.2: 1 -0.9,0; 2 0.9,0
0603-RES = smd 1.1 x 1: 1 -0.85,0; 2 0.85,0
PAD.03X.05 = smd 1.27 x 1.27: P$1 0,0
PAD.03X.04 = smd 1.016 x 1.016: P$1 0,0
8-SOIC = smd 0.55 x 1.2: P$1 -1.905,-2.87; P$2 -0.635,-2.87; P$3 0.635,-2.87; P$4 1.905,-2.87; P$5 1.905,2.87; P$6 0.635,2.87; P$7 -0.635,2.87; P$8 -1.905,2.87
TQFP-48 = smd 1.5 x 0.28: 1 -4.25,2.75; 2 -4.25,2.25; 3 -4.25,1.75; 4 -4.25,1.25; 5 -4.25,0.75; 6 -4.25,0.25; 7 -4.25,-0.25; 8 -4.25,-0.75; 9 -4.25,-1.25; 10 -4.25,-1.75; 11 -4.25,-2.25; 12 -4.25,-2.75; 25 4.25,-2.75; 26 4.25,-2.25; 27 4.25,-1.75; 28 4.25,-1.25; 29 4.25,-0.75; 30 4.25,-0.25; 31 4.25,0.25; 32 4.25,0.75; 33 4.25,1.25; 34 4.25,1.75; 35 4.25,2.25; 36 4.25,2.75 | smd 0.28 x 1.5: 13 -2.75,-4.25; 14 -2.25,-4.25; 15 -1.75,-4.25; 16 -1.25,-4.25; 17 -0.75,-4.25; 18 -0.25,-4.25; 19 0.25,-4.25; 20 0.75,-4.25; 21 1.25,-4.25; 22 1.75,-4.25; 23 2.25,-4.25; 24 2.75,-4.25; 37 2.75,4.25; 38 2.25,4.25; 39 1.75,4.25; 40 1.25,4.25; 41 0.75,4.25; 42 0.25,4.25; 43 -0.25,4.25; 44 -0.75,4.25; 45 -1.25,4.25; 46 -1.75,4.25; 47 -2.25,4.25; 48 -2.75,4.25
ABS06 = smd 0.762 x 1.397: P$1 -0.737,0; P$2 0.737,0

### Placement (x,y rotation side)
C1  60.75,33.84 270 bottom
C2  49.96,39.55 0 bottom
C4  49.96,32.88 0 bottom
C6  49.96,37.65 180 bottom
C7  50.27,44.95 90 bottom
C8  44.88,44 180 bottom
C9  47.73,44.95 270 bottom
C10  44.88,45.9 180 bottom
C11  43.13,30.5 270 bottom
C12  37.26,42.73 90 bottom
D1  57.66,17.33 350 bottom
D2  17.64,20.92 20 bottom
D3  35.51,32.67 10 bottom
FRAME1  -1.8,-1.72 0 top
J1  32.81,53.84 270 top
J3  48.37,28.12 0 bottom
L1  49.96,35.74 0 bottom
R1  56.47,37.65 180 bottom
R2  52.81,38.6 270 bottom
R3  17.72,23.93 200 bottom
R4  34.75,35.71 190 bottom
R5  56.23,19.98 170 bottom
R11  40.43,44 0 bottom
TP1  22.33,46.54 0 bottom
TP2  21.06,45.27 0 bottom
TP3  17.25,46.54 0 bottom
TP4  18.52,45.27 0 bottom
TP5  15.98,45.27 0 bottom
TP8  45.35,24.95 0 bottom
TP9  44.08,26.22 0 bottom
U1  55.67,33.84 90 bottom
U4  42.65,37.65 0 bottom
Y1  49,42.09 0 bottom

### Tracks (layer width: path | path; a pad name or v marks a point on that pad's centre or on a via)
3.3V  (via drill 0.3)
  Top 0.279: v50.91,34.47 v56.94,34.47
  Top 0.406: v47.1,48.44 47.1,39.87 | 47.1,39.87 44.44,37.21 v43.4,37.21 v42.18,37.21 | 47.1,39.87 v60.75,39.87
  Bottom 0.203: 60.54,34.47 C1.1
  Bottom 0.279: C8.1 43.4,43.37 U4.44 v43.4,37.21 | TP4.P$1 21.7,48.44 29.95,48.44 J1.1 | v43.4,37.21 41.18,37.21 40.11,38.28 40.11,39.87 39.59,40.4 U4.36 38.4,41.88 | v43.4,37.21 U4.17 43.4,31.63 C11.1 | 38.4,41.88 38.4,42.82 R11.2 | C12.1 38.4,41.88
  Bottom 0.406: v56.94,34.47 U1.P$6 60.54,34.47 | L1.1 50.91,35.64 v50.91,34.47 | J1.1 35.67,54.16 41.38,54.16 v47.1,48.44 | v60.75,39.87 C1.1
!RESET  (via drill 0.3)
  Top 0.203: v30.59,38.76 32.49,38.76 33.13,39.39 40.75,39.39 v41.38,38.76
  Bottom 0.203: R11.1 41.4,43.87 U4.40 41.4,38.78 v41.38,38.76 | TP3.P$1 17.25,44 20.43,40.82 28.53,40.82 v30.59,38.76
AUDIO+
  Bottom 0.203: U1.P$5 58.21,35.74 | R1.2 57.37,35.74 57.89,35.74
  Bottom 0.279: 58.21,35.74 57.89,35.74 56.62,35.74 55.51,34.63 55.51,30.34 54.56,29.39 J3.P$1
AUDIO-
  Bottom 0.279: U1.P$8 58.37,31.93 53.29,26.85 J3.P$2
D0/RX
  Bottom 0.203: U4.16 43.9,32.27 44.08,32.09 TP9.P$1
D1/TX
  Bottom 0.203: U4.15 44.4,32.4 45.35,31.46 TP8.P$1
DAC_OUT
  Bottom 0.203: U4.3 48.95,39.4 C2.2
GND
  Bottom 0.203: 60.54,33.2 C1.2 | C7.2 C9.1
  Bottom 0.279: U1.P$7 60.54,33.2 | C8.2 C10.2
  pour Top: 7.09,40.19 arc-90 18.52,51.62 27.41,51.62 arc-90 32.49,56.7 45.19,56.7 arc-90 50.27,51.62 68.05,51.62 arc-90 89.64,30.03 arc-90 73.13,-0.45 12.17,-0.45 arc-90 -0.53,31.3 -0.53,32.57 arc-90
  pour Bottom: 27.41,51.62 arc-90 32.49,56.7 43.92,56.7 arc-90 49,51.62 68.05,51.62 arc-90 89.64,30.03 arc-90 73.13,-0.45 12.17,-0.45 arc-90 -0.53,31.3 arc-90 19.79,51.62
LED1  (via drill 0.3)
  Top 0.203: v41.38,30.03 47.1,24.31 v48.69,24.31
  Bottom 0.203: U4.23 40.4,31.01 v41.38,30.03 | R5.2 56.85,20.34 56.62,20.34 52.66,24.31 v48.69,24.31
LED2  (via drill 0.3)
  Top 0.203: v39.9,27.17 v22.33,27.17
  Bottom 0.203: U4.24 v39.9,27.17 | v22.33,27.17 19,23.84 18.72,23.84 R3.2
LED3
  Bottom 0.279: U4.26 36.46,35.4 R4.2
N$1
  Bottom 0.203: R2.1 52.76,39.55 C2.1
N$2
  Bottom 0.203: R1.1 52.87,37.65 R2.2 52.8,37.69 U1.P$4
N$3
  Bottom 0.203: D1.P$2 55.45,20.06 R5.1
N$4
  Bottom 0.203: Y1.P$1 49.74,43.57 C7.1
  Bottom 0.254: U4.2 47.92,39.9 49.74,41.72 Y1.P$1
N$5
  Bottom 0.203: C4.1 50.81,33.2 U1.P$2 U1.P$3
N$6
  Bottom 0.203: D2.P$2 16.98,24.09 R3.1
N$7
  Bottom 0.203: D3.P$2 34.26,35.37 R4.1
N$9
  Bottom 0.203: Y1.P$2 48.27,43.57 C9.2
  Bottom 0.254: U4.1 47.63,40.4 48.27,41.04 Y1.P$2
SCL_IN
  Bottom 0.203: U4.32 36.98,38.4 35.35,40.03 35.35,48.76 J1.4
SDA_IN
  Bottom 0.203: U4.31 36.85,37.9 34.88,39.87 34.88,48.92 35.35,49.4 35.35,51.3 J1.2
STDN
  Bottom 0.203: U1.P$1 46.31,31.93 45.4,32.83 U4.13
SWCLK  (via drill 0.3)
  Top 0.203: v31.38,39.55 32.49,39.55 32.81,39.87 44.08,39.87 v44.4,39.55
  Bottom 0.203: U4.45 43.9,40.05 v44.4,39.55 | v31.38,39.55 29.16,41.78 24.56,41.78 TP2.P$1
SWDIO  (via drill 0.3)
  Top 0.203: v32.18,40.35 v45.04,40.35
  Bottom 0.203: v32.18,40.35 29.8,42.73 26.14,42.73 TP1.P$1 | v45.04,40.35 44.4,40.98 U4.46
VDDANA
  Bottom 0.279: U4.6 48.86,37.9 C6.1 L1.2
VDDCORE
  Bottom 0.279: U4.43 42.9,44.78 C10.1

### Text on the board
Bottom: DC / 26
bPlace: SDA | SCL | GND | GND | !RESET | 3V3 | SWCLK | SWDIO | crAPU add-on / scaremin / @mediumrehr | + | git.io/crAPUs | SPEAKER / OUT | - | RX | TX